# EAGLE design hiral pcb (EAGLE 9.6.2)
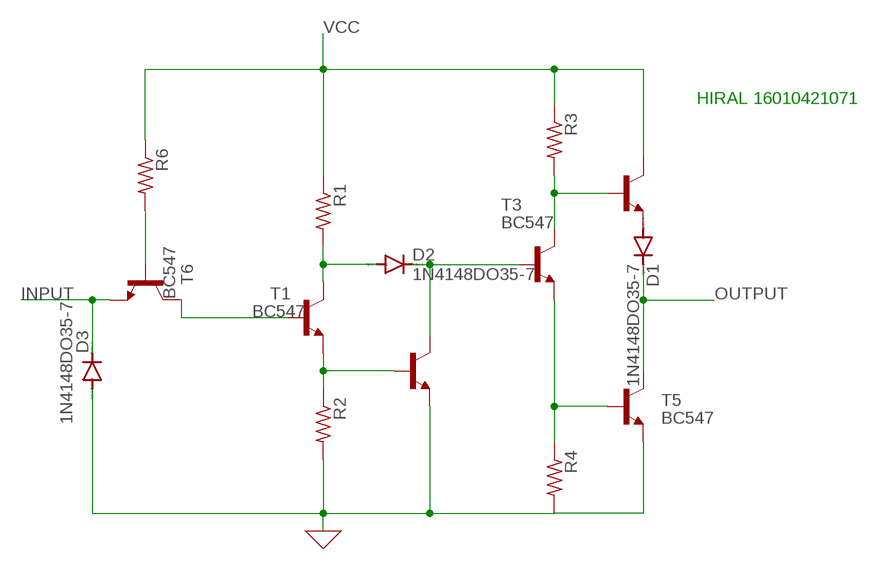
[diagram p0: schematic, sheet 1]

## Parts
D1  1N4148DO35-7  [DO35-7]
D2  1N4148DO35-7  [DO35-7]
D3  1N4148DO35-7  [DO35-7]
R1  R-US_0204/5  [0204/5]
R2  R-US_0204/5  [0204/5]
R3  R-US_0204/5  [0204/5]
R4  R-US_0204/5  [0204/5]
R6  R-US_0204/5  [0204/5]
T1  BC547  [TO92]
T2  BC547  [TO92]
T3  BC547  [TO92]
T4  BC547  [TO92]
T5  BC547  [TO92]
T6  BC547  [TO92]

## Nets
0: D3.A R2.2 R4.2 T2.1(E) T5.1(E) ; supply symbol labelled GND
INPUT: D3.C T6.1(E)
N$1: R6.2 T6.2(B)
N$3: D1.A T4.1(E)
N$5: R4.1 T3.1(E) T5.2(B)
N$7: D2.A R1.2 T1.3(C)
N$8: R2.1 T1.1(E) T2.2(B)
N$9: R3.2 T3.3(C) T4.2(B)
N$10: D2.C T2.3(C) T3.2(B)
N$11: T1.2(B) T6.3(C)
OUTPUT: D1.C T5.3(C)
VCC: R1.1 R3.1 R6.1 T4.3(C)

## Notes on the sheet
- HIRAL 16010421071

## Library data of the parts
D1-D3 = diode:1N4148: DIODE high speed (Philips)
R1-R4 R6 = rcl:R-US_: RESISTOR, American symbol; SPICEPREFIX: R
T1-T6 = transistor:BC547: NPN TRANSISTOR

## Board
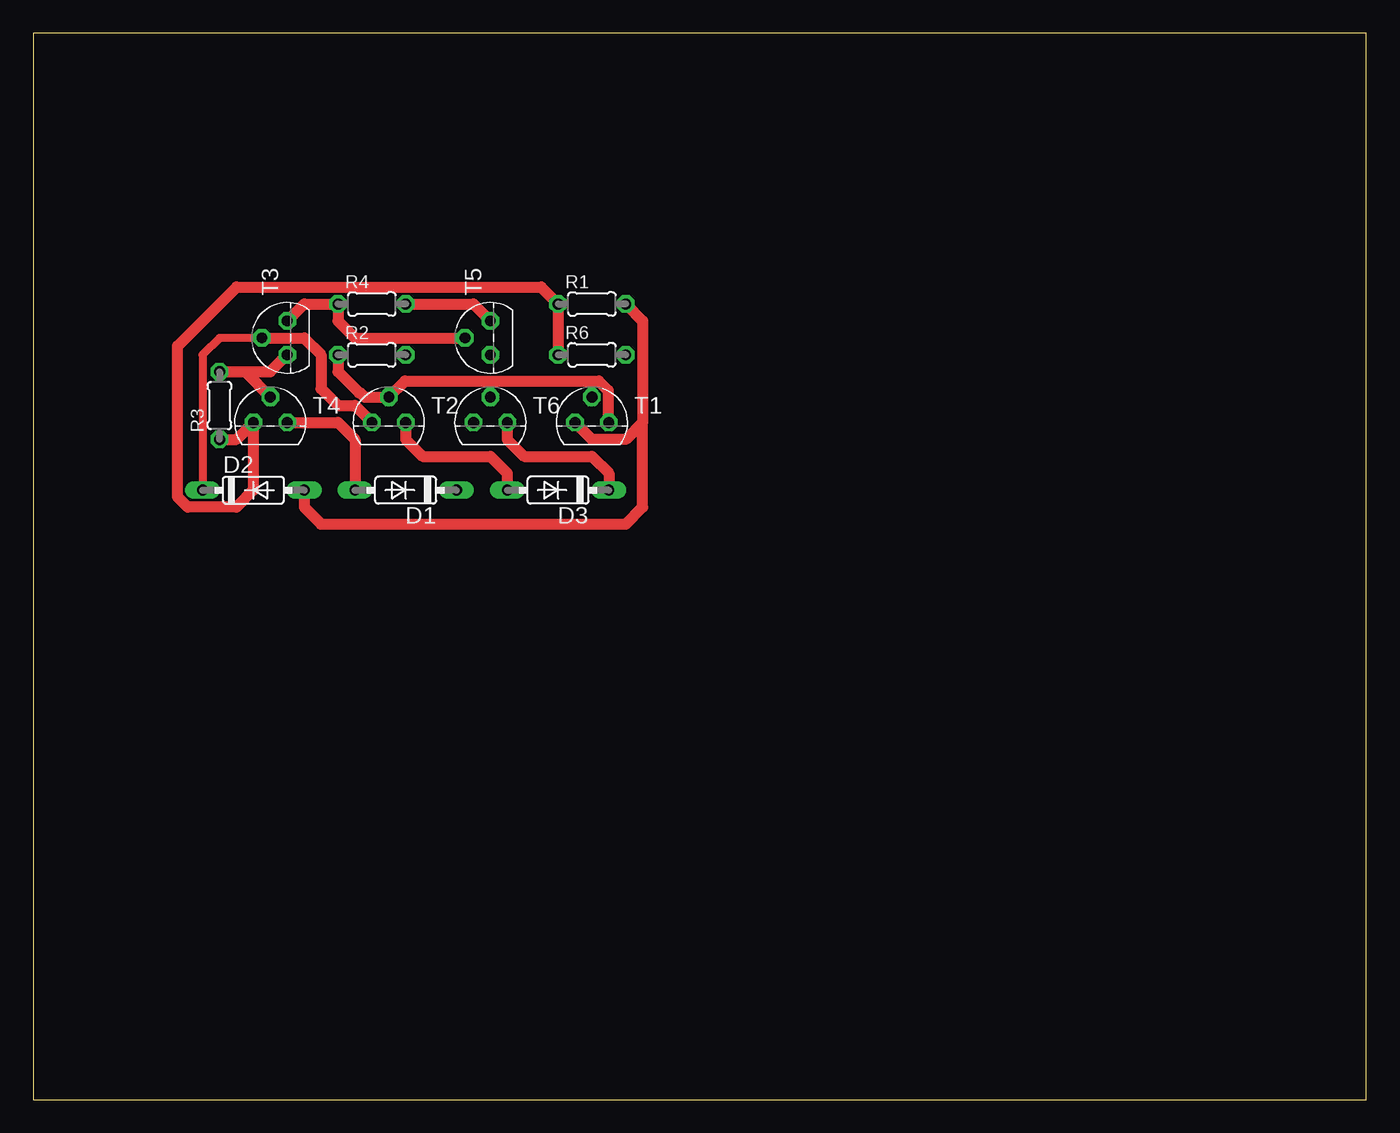
[diagram p1: board, top side]
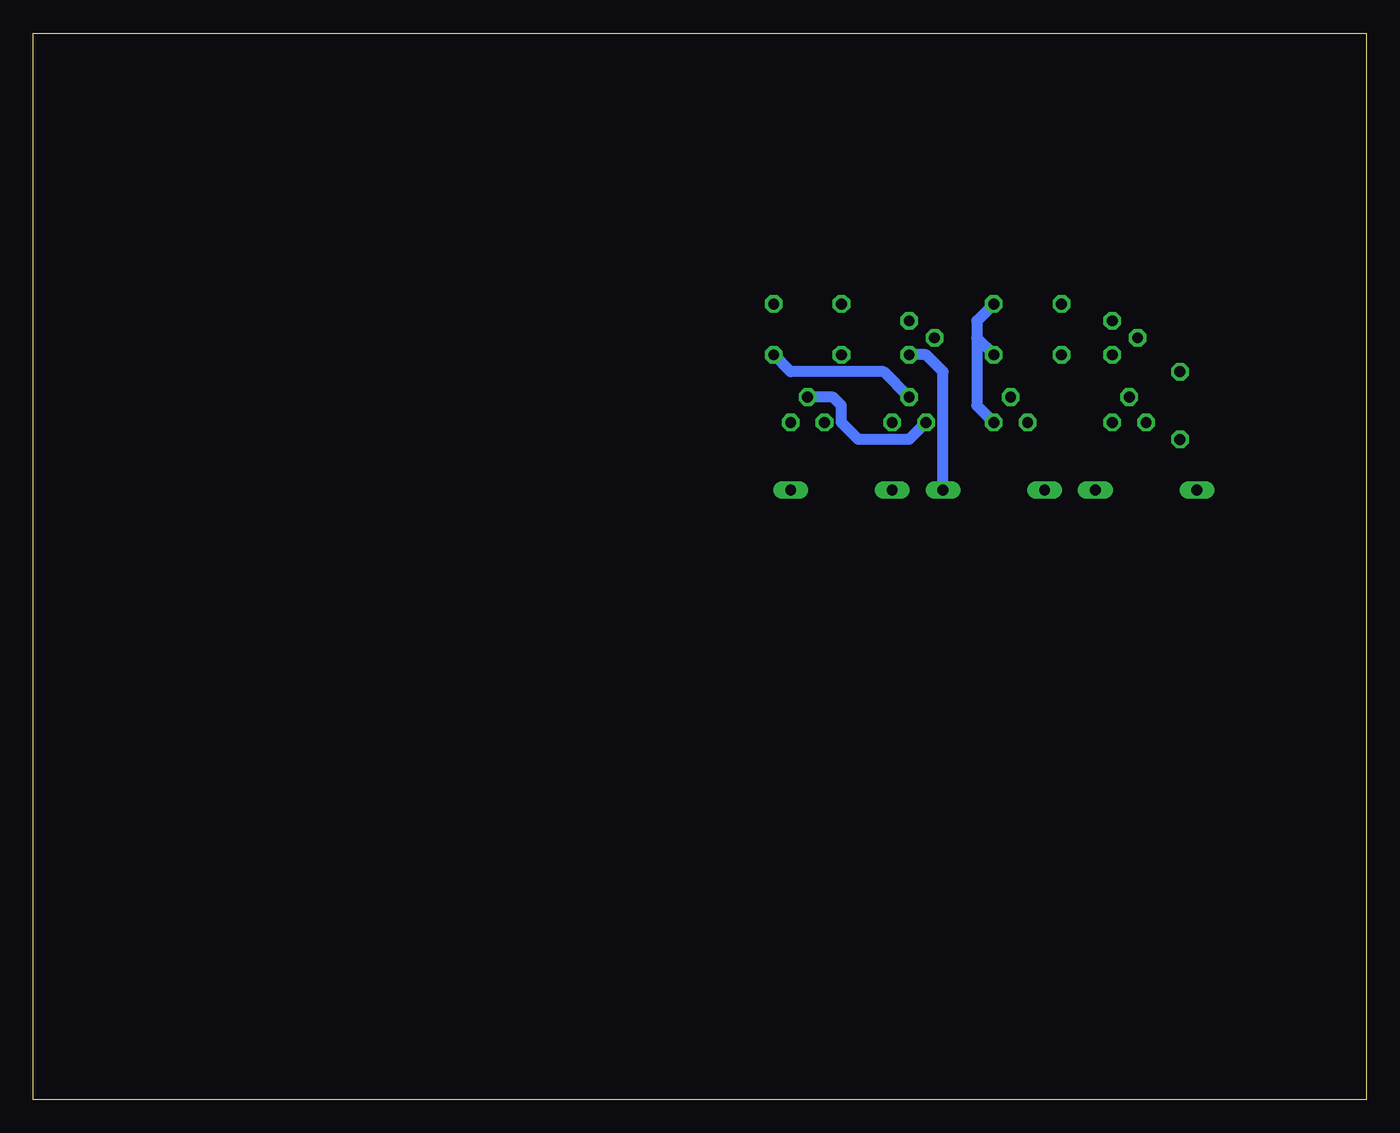
[diagram p2: board, bottom side, seen from below]

Size 100 x 80 mm. Coordinates in mm from the lower left corner, seen from the top.
Outline: 0,0 100,0 100,80 0,80 0,0
Copper layers (1*16): Top 0.035mm / dielectric 1.5mm / Bottom 0.035mm
Design rules "default": minimum track width 6mil, minimum drill 0.35mm, track to track 6mil, track to pad 6mil, pad to pad 6mil, via to via 6mil, smd to smd 6mil, copper to edge 40mil, drill to drill 6mil, minimum pad ring 10mil, minimum via ring 8mil, stop-mask expansion 4mil, vias tented up to drill 0mil, thermal gap 10mil

### Footprints (pad centres in the part's own frame; a part is rotated, then mirrored left to right if it is on the bottom)
DO35-7 = drill 0.813 long: A 3.81,0; C -3.81,0
0204/5 = drill 0.813 octagon: 1 -2.54,0; 2 2.54,0
TO92 = drill 0.813 octagon: 1 1.27,0; 2 0,1.905; 3 -1.27,0

### Placement (x,y rotation side)
D1  27.94,45.72 180 top
D2  16.51,45.72 0 top
D3  39.37,45.72 180 top
R1  41.91,59.69 0 top
R2  25.4,55.88 0 top
R3  13.97,52.07 90 top
R4  25.4,59.69 0 top
R6  41.91,55.88 0 top
T1  41.91,50.8 0 top
T2  26.67,50.8 0 top
T3  19.05,57.15 90 top
T4  17.78,50.8 0 top
T5  34.29,57.15 90 top
T6  34.29,50.8 0 top

### Tracks (layer width: path | path; a pad name or v marks a point on that pad's centre or on a via)
0
  Top 0.813: R4.2 33.02,59.69 T5.1 | T2.1 27.94,49.53 29.21,48.26 34.29,48.26 35.56,46.99 D3.A
  Bottom 0.813: R4.2 29.21,58.42 29.21,57.15 | 29.21,57.15 R2.2 | 29.21,57.15 29.21,52.07 T2.1
INPUT
  Top 0.813: T6.1 35.56,49.53 36.83,48.26 41.91,48.26 43.18,46.99 D3.C
N$1
  Bottom 0.813: T6.2 36.2,54.61 43.18,54.61 R6.2
N$3
  Top 0.813: T4.1 22.86,50.8 24.13,49.53 D1.A
N$5
  Top 0.813: T3.1 20.32,59.69 R4.1 22.86,58.42 24.13,57.15 T5.2
N$7
  Top 0.813: R1.2 45.72,58.42 45.72,50.8 | 45.72,50.8 44.45,49.53 41.91,49.53 T1.3 | D2.A 20.32,44.45 21.59,43.18 44.45,43.18 45.72,44.45 45.72,50.8
N$8
  Top 0.813: R2.1 22.86,54.61 24.43,53.03 24.53,53.03 24.86,52.7 T2.2 27.89,53.92 42.41,53.92 43.13,53.21 43.13,50.85 T1.1
N$9
  Top 0.813: R3.2 15.24,54.61 15.88,54.61 | 15.88,54.61 T4.2 | 15.88,54.61 17.78,54.61 T3.3
N$10
  Top 0.61: T3.2 13.97,57.15 12.7,55.88 D2.C
  Top 0.813: T3.2 20.32,57.15 21.59,55.88 21.59,53.34 22.86,52.07 24.13,52.07 T2.3
N$11
  Bottom 0.813: T6.3 34.29,49.53 38.1,49.53 39.37,50.8 39.37,52.07 40.01,52.7 T1.2
OUTPUT
  Bottom 0.813: D1.C 31.75,54.61 33.02,55.88 T5.3
VCC
  Top 0.813: R3.1 15.24,49.53 T4.3 16.51,45.72 15.24,44.45 11.59,44.45 10.82,45.22 10.82,45.72 10.82,46.23 10.82,56.54 15.24,60.96 38.1,60.96 R1.1 R6.1